# EAGLE design secondboard (EAGLE 9.6.2)
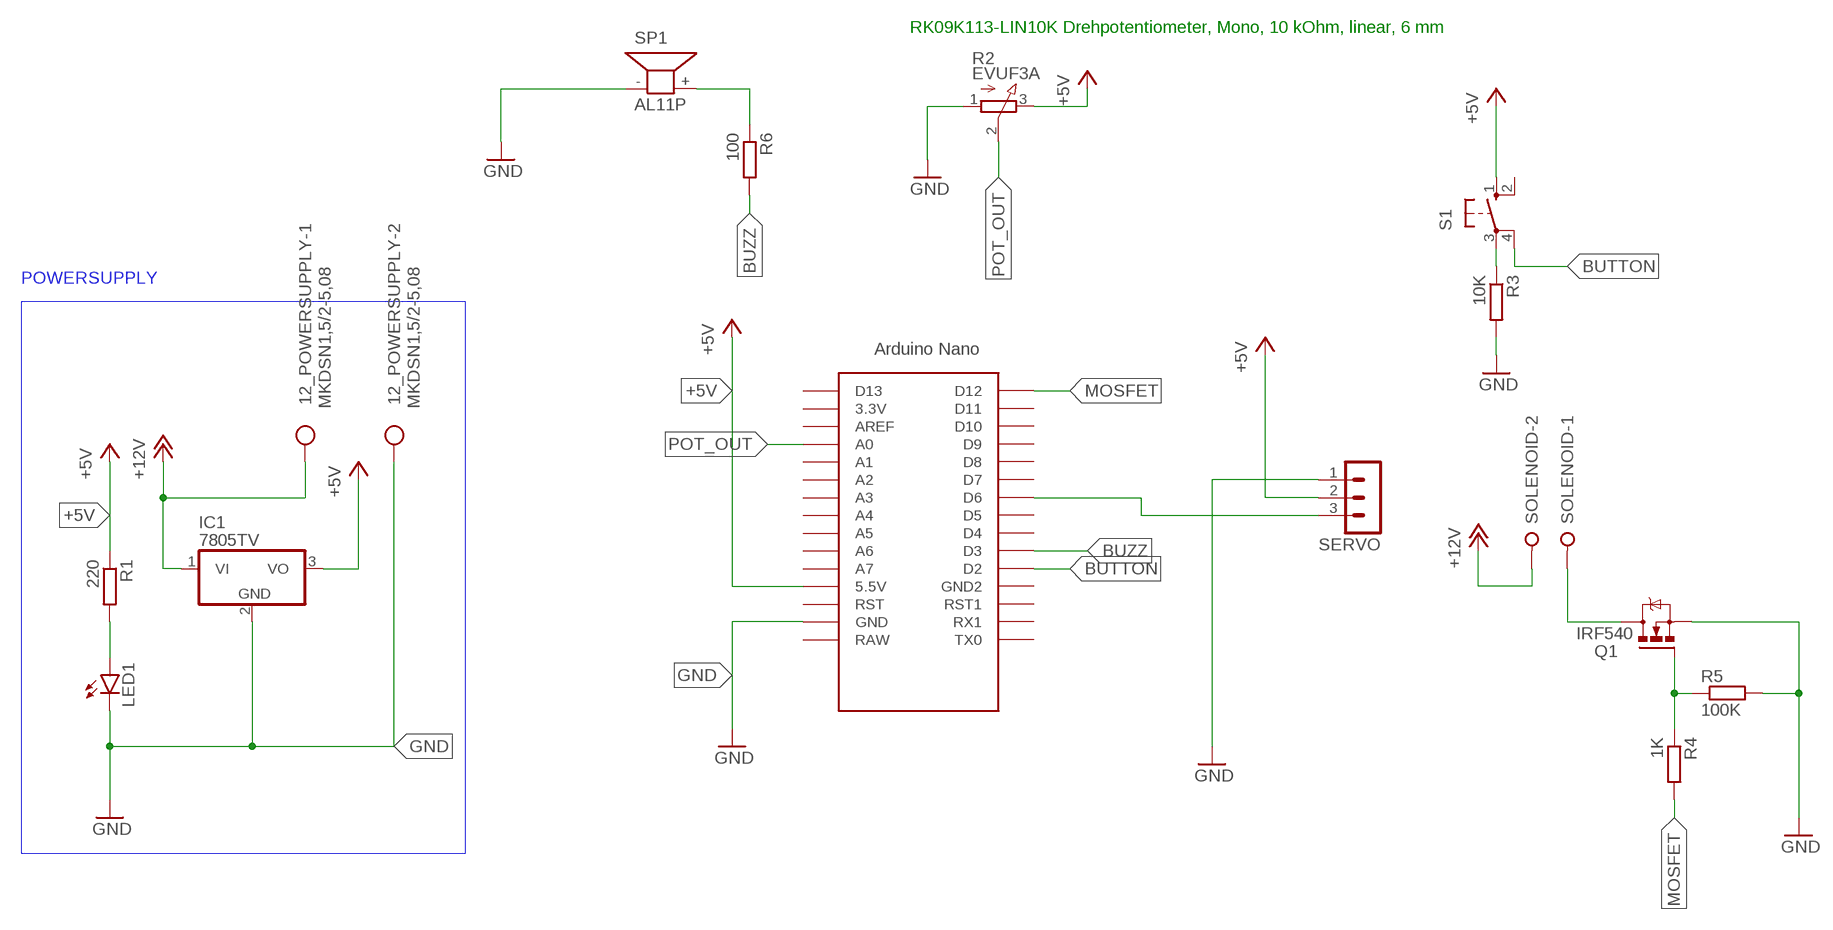
[diagram p0: schematic, sheet 1]

## Parts
12_POWERSUPPLY  MKDSN1,5/2-5,08  [MKDSN1,5/2-5,08]
IC1  7805TV  [TO220V]
LED1  LED3MM  [LED3MM]
Q1  IRF540  [TO220BV]
R1  220  R-EU_R0805  [R0805]
R2  EVUF3A  [EVUF]
R3  10K  R-EU_R0805  [R0805]
R4  1K  R-EU_R0805  [R0805]
R5  100K  R-EU_R0805  [R0805]
R6  100  R-EU_R0805  [R0805]
S1  10-XX  [B3F-10XX]
SERVO  MA03-1  [MA03-1]
SOLENOID  W237-02P  [W237-132]
SP1  AL11P  [AL11P]
U$1  NANO  [NANO]

## Nets
+5V: IC1.3(VO) R1.1 R2.3(E) S1.1(S) SERVO.2 U$1.5V(5.5V)
+12V: 12_POWERSUPPLY.1 IC1.1(VI) SOLENOID.2
BUTTON: S1.4(P1) U$1.D2
BUZZ: R6.2 U$1.D3
CONNECT: LED1.A R1.2
GND: 12_POWERSUPPLY.2 IC1.2(GND) LED1.K(C) Q1.S R2.1(A) R3.2 R5.2 SERVO.1 SP1.- U$1.GND
MOSFET: R4.2 U$1.D12
N$1: R3.1 S1.3(P)
N$2: R6.1 SP1.+
N$3: Q1.D SOLENOID.1
N$4: SERVO.3 U$1.D6
N$6: Q1.G R4.1 R5.1
POT_OUT: R2.2(S) U$1.A0
Unconnected: S1.2(S1) U$1.3.3V U$1.A1 U$1.A2 U$1.A3 U$1.A4 U$1.A5 U$1.A6 U$1.A7 U$1.AREF U$1.D4 U$1.D5 U$1.D7 U$1.D8 U$1.D9 U$1.D10 U$1.D11 U$1.D13 U$1.GND1(GND2) U$1.ICSP1 U$1.ICSP2 U$1.ICSP3 U$1.ICSP4 U$1.ICSP5 U$1.ICSP6 U$1.RAW U$1.RST U$1.RST1 U$1.RX1 U$1.TX0

## Notes on the sheet
- RK09K113-LIN10K Drehpotentiometer, Mono, 10 kOhm, linear, 6 mm
- POWERSUPPLY

## Library data of the parts
12_POWERSUPPLY = con-phoenix-508:MKDSN1,5/2-5,08: MKDSN 1,5/ 2-5,08 Printklemme Nennstrom: 13,5 A Nennspannung: 250 V Rastermaß: 5,08 mm Polzahl: 2 Anschlussart: Schraubanschluss Montage: Löten Anschlussrichtung Leiter/Platine: 0 ° Artikelnummer: 1729128 Source: http://eshop.phoenixcontact.com .. 1729128.pdf
IC1 = linear:78*: Positive VOLTAGE REGULATOR Source: http://cache.national.com/ds/LM/LM78L05.pdf http://www.fairchildsemi.com/ds/LM/LM7805.pdf
LED1 = led:LED: LED OSRAM: - CHIPLED LG R971, LG N971, LY N971, LG Q971, LY Q971, LO R971, LY R971 LH N974, LH R974 LS Q976, LO Q976, LY Q976 LO Q996 - Hyper CHIPLED LW Q18S LB Q993, LB Q99A, LB R99A - SideLED LS A670, LO A670, LY A670, LG A670, LP A670 LB A673, LV A673, LT A673, LW A673 LH A674 LY A675 LS A676, LA A676, LO A676, LY A676, LW A676 LS A679, LY A679, LG A679 - Hyper Micro SIDELED® LS Y876, LA Y876, LO Y876, LY Y876 LT Y87S - SmartLED LW L88C, LW L88S LB L89C, LB L89S, LG L890 LS L89K, LO L89K, LY L89K LS L896, LA L896, LO L896, LY L896 - TOPLED LS T670, LO T670, LY T670, LG T670, LP T670 LSG T670, LSP T670, LSY T670, LOP T670, LYG T670 LG T671, LOG T671, LSG T671 LB T673, LV T673, LT T673, LW T673 LH T674 LS T676, LA T676, LO T676, LY T676, LB T676, LH T676, LSB T676, LW T676 LB T67C, LV T67C, LT T67C, LS T67K, LO T67K, LY T67K, LW E67C LS E67B, LA E67B, LO E67B, LY E67B, LB E67C, LV E67C, LT E67C LW T67C LS T679, LY T679, LG T679 LS T770, LO T770, LY T770, LG T770, LP T770 LB T773, LV T773, LT T773, LW T773 LH T774 LS E675, LA E675, LY E675, LS T675 LS T776, LA T776, LO T776, LY T776, LB T776 LHGB T686 LT T68C, LB T68C - Hyper Mini TOPLED® LB M676 - Mini TOPLED Santana® LG M470 LS M47K, LO M47K, LY M47K Source: http://www.osram.convergy.de LUXEON: - LUMILED® LXK2-PW12-R00, LXK2-PW12-S00, LXK2-PW14-U00, LXK2-PW14-V00 LXK2-PM12-R00, LXK2-PM12-S00, LXK2-PM14-U00 LXK2-PE12-Q00, LXK2-PE12-R00, LXK2-PE12-S00, LXK2-PE14-T00, LXK2-PE14-U00 LXK2-PB12-K00, LXK2-PB12-L00, LXK2-PB12-M00, LXK2-PB14-N00, LXK2-PB14-P00, LXK2-PB14-Q00 LXK2-PR12-L00, LXK2-PR12-M00, LXK2-PR14-Q00, LXK2-PR14-R00 LXK2-PD12-Q00, LXK2-PD12-R00, LXK2-PD12-S00 LXK2-PH12-R00, LXK2-PH12-S00 LXK2-PL12-P00, LXK2-PL12-Q00, LXK2-PL12-R00 Source: www.luxeon.com KINGBRIGHT: KA-3528ASYC Source: www.kingbright.com
Q1 = transistor-power:IRF540: HEXFET Power MOSFET
R1 R3-R6 = rcl:R-EU_: RESISTOR, European symbol; SPICEPREFIX: R
R2 = pot:EVU: 9 mm Square Rotary Potentiometers Source: Panasonic
S1 = switch-omron:10-XX: OMRON SWITCH; MPN: B3F-1000; OC_FARNELL: 176432; OC_NEWARK: 36M3542
SERVO = con-lstb:MA03-1: PIN HEADER; OC_FARNELL: unknown; OC_NEWARK: unknown
SOLENOID = con-wago-508:W237-02P: WAGO SREW CLAMP; OC_FARNELL: unknown; OC_NEWARK: unknown
SP1 = buzzer:AL11P: SPEAKER Source: Buerklin; OC_FARNELL: unknown; OC_NEWARK: unknown
U$1 = Arduino-clone:NANO: Arduino Nano

## Board
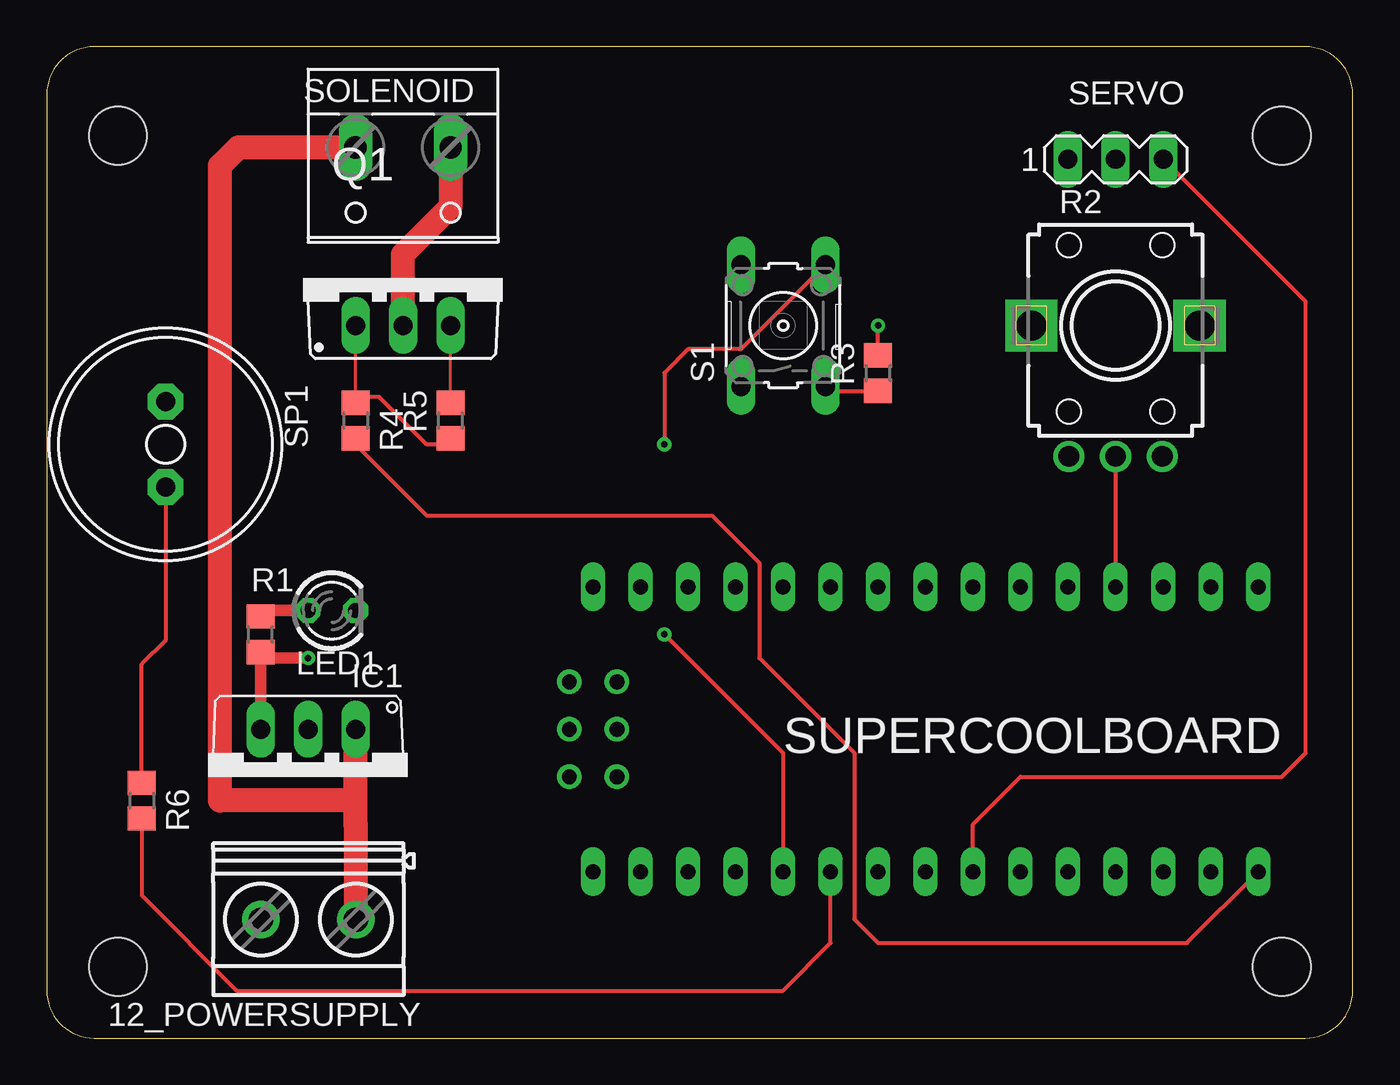
[diagram p1: board, top side]
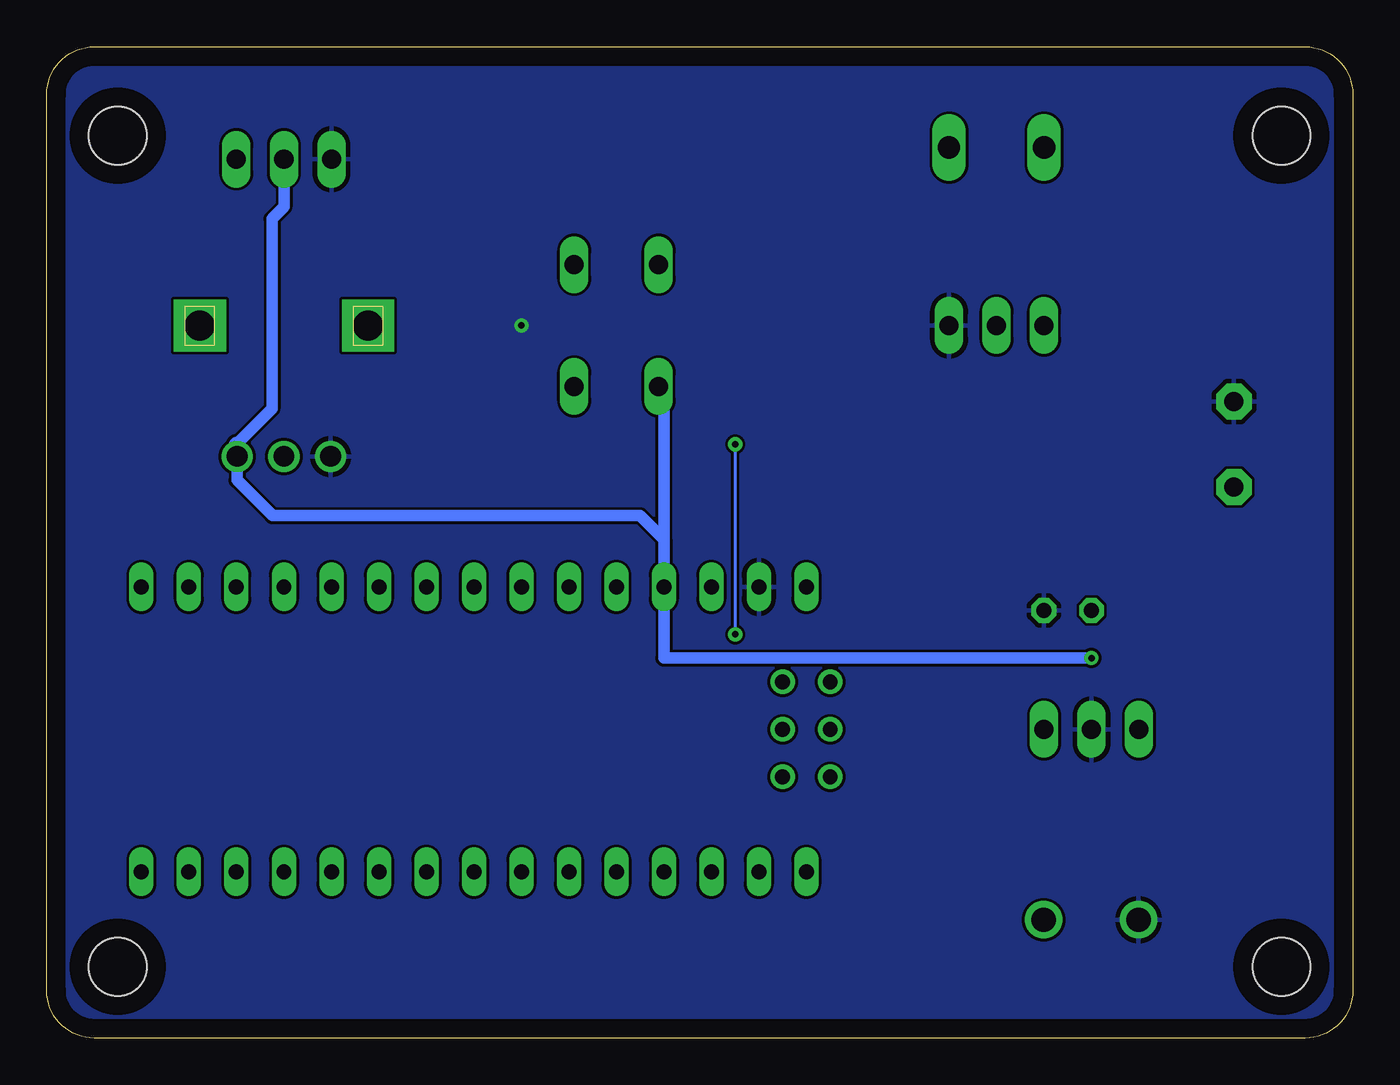
[diagram p2: board, bottom side, seen from below]

Size 69.83 x 53.01 mm. Coordinates in mm from the lower left corner, seen from the top.
Outline: 2.54,0 67.29,0 arc90 69.83,2.54 69.83,50.47 arc90 67.29,53.01 2.54,53.01 arc90 0,50.47 0,2.54 arc90 2.54,0
Copper layers (1*16): Top 0.035mm / dielectric 1.5mm / Bottom 0.035mm
Design rules "default": minimum track width 6mil, minimum drill 0.35mm, track to track 6mil, track to pad 6mil, pad to pad 6mil, via to via 6mil, smd to smd 6mil, copper to edge 40mil, drill to drill 6mil, minimum pad ring 10mil, minimum via ring 8mil, stop-mask expansion 4mil, vias tented up to drill 0mil, thermal gap 10mil
Holes 3.1 mm at 3.81,48.26 66.04,3.81 3.81,3.81 66.04,48.26

### Footprints (pad centres in the part's own frame; a part is rotated, then mirrored left to right if it is on the bottom)
MKDSN1,5/2-5,08 = drill 1.3 pad 2: 1 -2.561,0.025; 2 2.519,0.025
TO220V = drill 1.016 long: 1 -2.54,-2.54; 2 0,-2.54; 3 2.54,-2.54
LED3MM = drill 0.813 octagon: A -1.27,0; K 1.27,0
TO220BV = drill 1.016 long: D 0,-2.54; G -2.54,-2.54; S 2.54,-2.54
R0805 = smd 1.3 x 1.5: 1 -0.95,0; 2 0.95,0
EVUF = drill 1.1 pad 1.676: 1 -2.5,-7; 2 0,-7; 3 2.5,-7 | drill 1.6 pad 2.8 square: M1 4.5,0; M2 -4.5,0
B3F-10XX = drill 1.016 long: 1 -3.251,2.261; 2 3.251,2.261; 3 -3.251,-2.261; 4 3.251,-2.261
MA03-1 = drill 1.016 long: 1 -2.54,0; 2 0,0; 3 2.54,0
W237-132 = drill 1.194 long: 1 -2.54,-0.635; 2 2.54,-0.635
AL11P = drill 1.016 pad 1.905 octagon: + 2.286,0; - -2.286,0
NANO = drill 0.8 long: 3.3V -10.16,24.13; 5V -10.16,-1.27; A0 -10.16,19.05; A1 -10.16,16.51; A2 -10.16,13.97; A3 -10.16,11.43; A4 -10.16,8.89; A5 -10.16,6.35; A6 -10.16,3.81; A7 -10.16,1.27; AREF -10.16,21.59; D2 5.08,1.27; D3 5.08,3.81; D4 5.08,6.35; D5 5.08,8.89; D6 5.08,11.43; D7 5.08,13.97; D8 5.08,16.51; D9 5.08,19.05; D10 5.08,21.59; D11 5.08,24.13; D12 5.08,26.67; D13 -10.16,26.67; GND -10.16,-6.35; GND1 5.08,-1.27; RAW -10.16,-8.89; RST -10.16,-3.81; RST1 5.08,-3.81; RX1 5.08,-6.35; TX0 5.08,-8.89 | drill 0.8: ICSP1 -5.08,-10.16; ICSP2 -5.08,-7.62; ICSP3 -2.54,-10.16; ICSP4 -2.54,-7.62; ICSP5 0,-10.16; ICSP6 0,-7.62

### Placement (x,y rotation side)
12_POWERSUPPLY  13.97,6.35 180 top
IC1  13.97,13.97 180 top
LED1  15.24,22.86 0 top
Q1  19.05,40.64 0 top
R1  11.43,21.59 90 top
R2  57.15,38.1 0 top
R3  44.45,35.56 90 top
R4  16.51,33.02 270 top
R5  21.59,33.02 90 top
R6  5.08,12.7 270 top
S1  39.37,38.1 90 top
SERVO  57.15,46.99 0 top
SOLENOID  19.05,46.99 180 top
SP1  6.35,31.75 270 top
U$1  38.1,13.97 270 top

### Tracks (layer width: path | path; a pad name or v marks a point on that pad's centre or on a via)
+5V  (via drill 0.35)
  Top 0.61: v13.97,20.32 11.75,20.32 R1.1 IC1.3
  Bottom 0.61: R2.3 59.65,29.83 57.76,27.94 38.1,27.94 36.83,26.67 U$1.5V | 59.69,31.75 57.78,33.66 57.78,43.81 57.15,44.45 SERVO.2 | U$1.5V 36.83,20.32 v13.97,20.32 | U$1.5V 36.83,34.57 S1.1
  Bottom 0.813: R2.3 59.65,31.71 59.69,31.75
+12V
  Top 1.27: 12_POWERSUPPLY.1 16.53,11.4 16.51,11.43 16.51,12.7 | 16.51,12.7 IC1.1 | 16.51,12.7 9.27,12.7 9.27,46.65 10.24,47.62 SOLENOID.2
BUTTON  (via drill 0.35)
  Top 0.203: S1.4 37.11,36.83 34.29,36.83 33.02,35.56 v33.02,31.75 | v33.02,21.59 39.37,15.24 U$1.D2
  Bottom 0.152: v33.02,31.75 v33.02,21.59
BUZZ
  Top 0.203: R6.2 5.08,7.62 10.16,2.54 39.37,2.54 41.91,5.08 U$1.D3
CONNECT
  Top 0.61: R1.2 11.43,22.86 LED1.A
GND  (via drill 0.35)
  Top 0.152: R5.2 Q1.S
  Top 0.203: R3.2 v44.45,38.1
  pour Bottom: -1.27,55.88 72.39,55.88 72.39,-1.27 -1.27,-1.27
MOSFET
  Top 0.152: R4.2 16.51,31.75
  Top 0.203: 16.51,31.75 20.32,27.94 35.56,27.94 38.1,25.4 38.1,20.32 43.18,15.24 43.18,6.35 44.45,5.08 60.96,5.08 U$1.D12
N$1
  Top 0.152: S1.3 41.87,34.61
  Top 0.203: 41.87,34.61 R3.1
N$2
  Top 0.203: SP1.+ 6.35,21.27 5.08,20 R6.1
N$3
  Top 1.27: SOLENOID.1 21.59,44.45 19.05,41.91 Q1.D
N$4
  Top 0.203: U$1.D6 49.53,11.43 52.07,13.97 66.04,13.97 67.31,15.24 67.31,39.37 SERVO.3
N$6
  Top 0.152: R4.1 16.51,34.29 Q1.G | R5.1 21.27,31.75
  Top 0.203: 21.27,31.75 20.32,31.75 17.78,34.29 16.51,34.29
POT_OUT
  Top 0.203: R2.2 U$1.A0

### Text on the board
tNames: SUPERCOOLBOARD